# Altium schematic sheet 04 - Auxiliary Power.SchDoc: Auxiliary Power - 25kW WolfPACK FM3 Six-Pack Inv. (part 3 of 3)
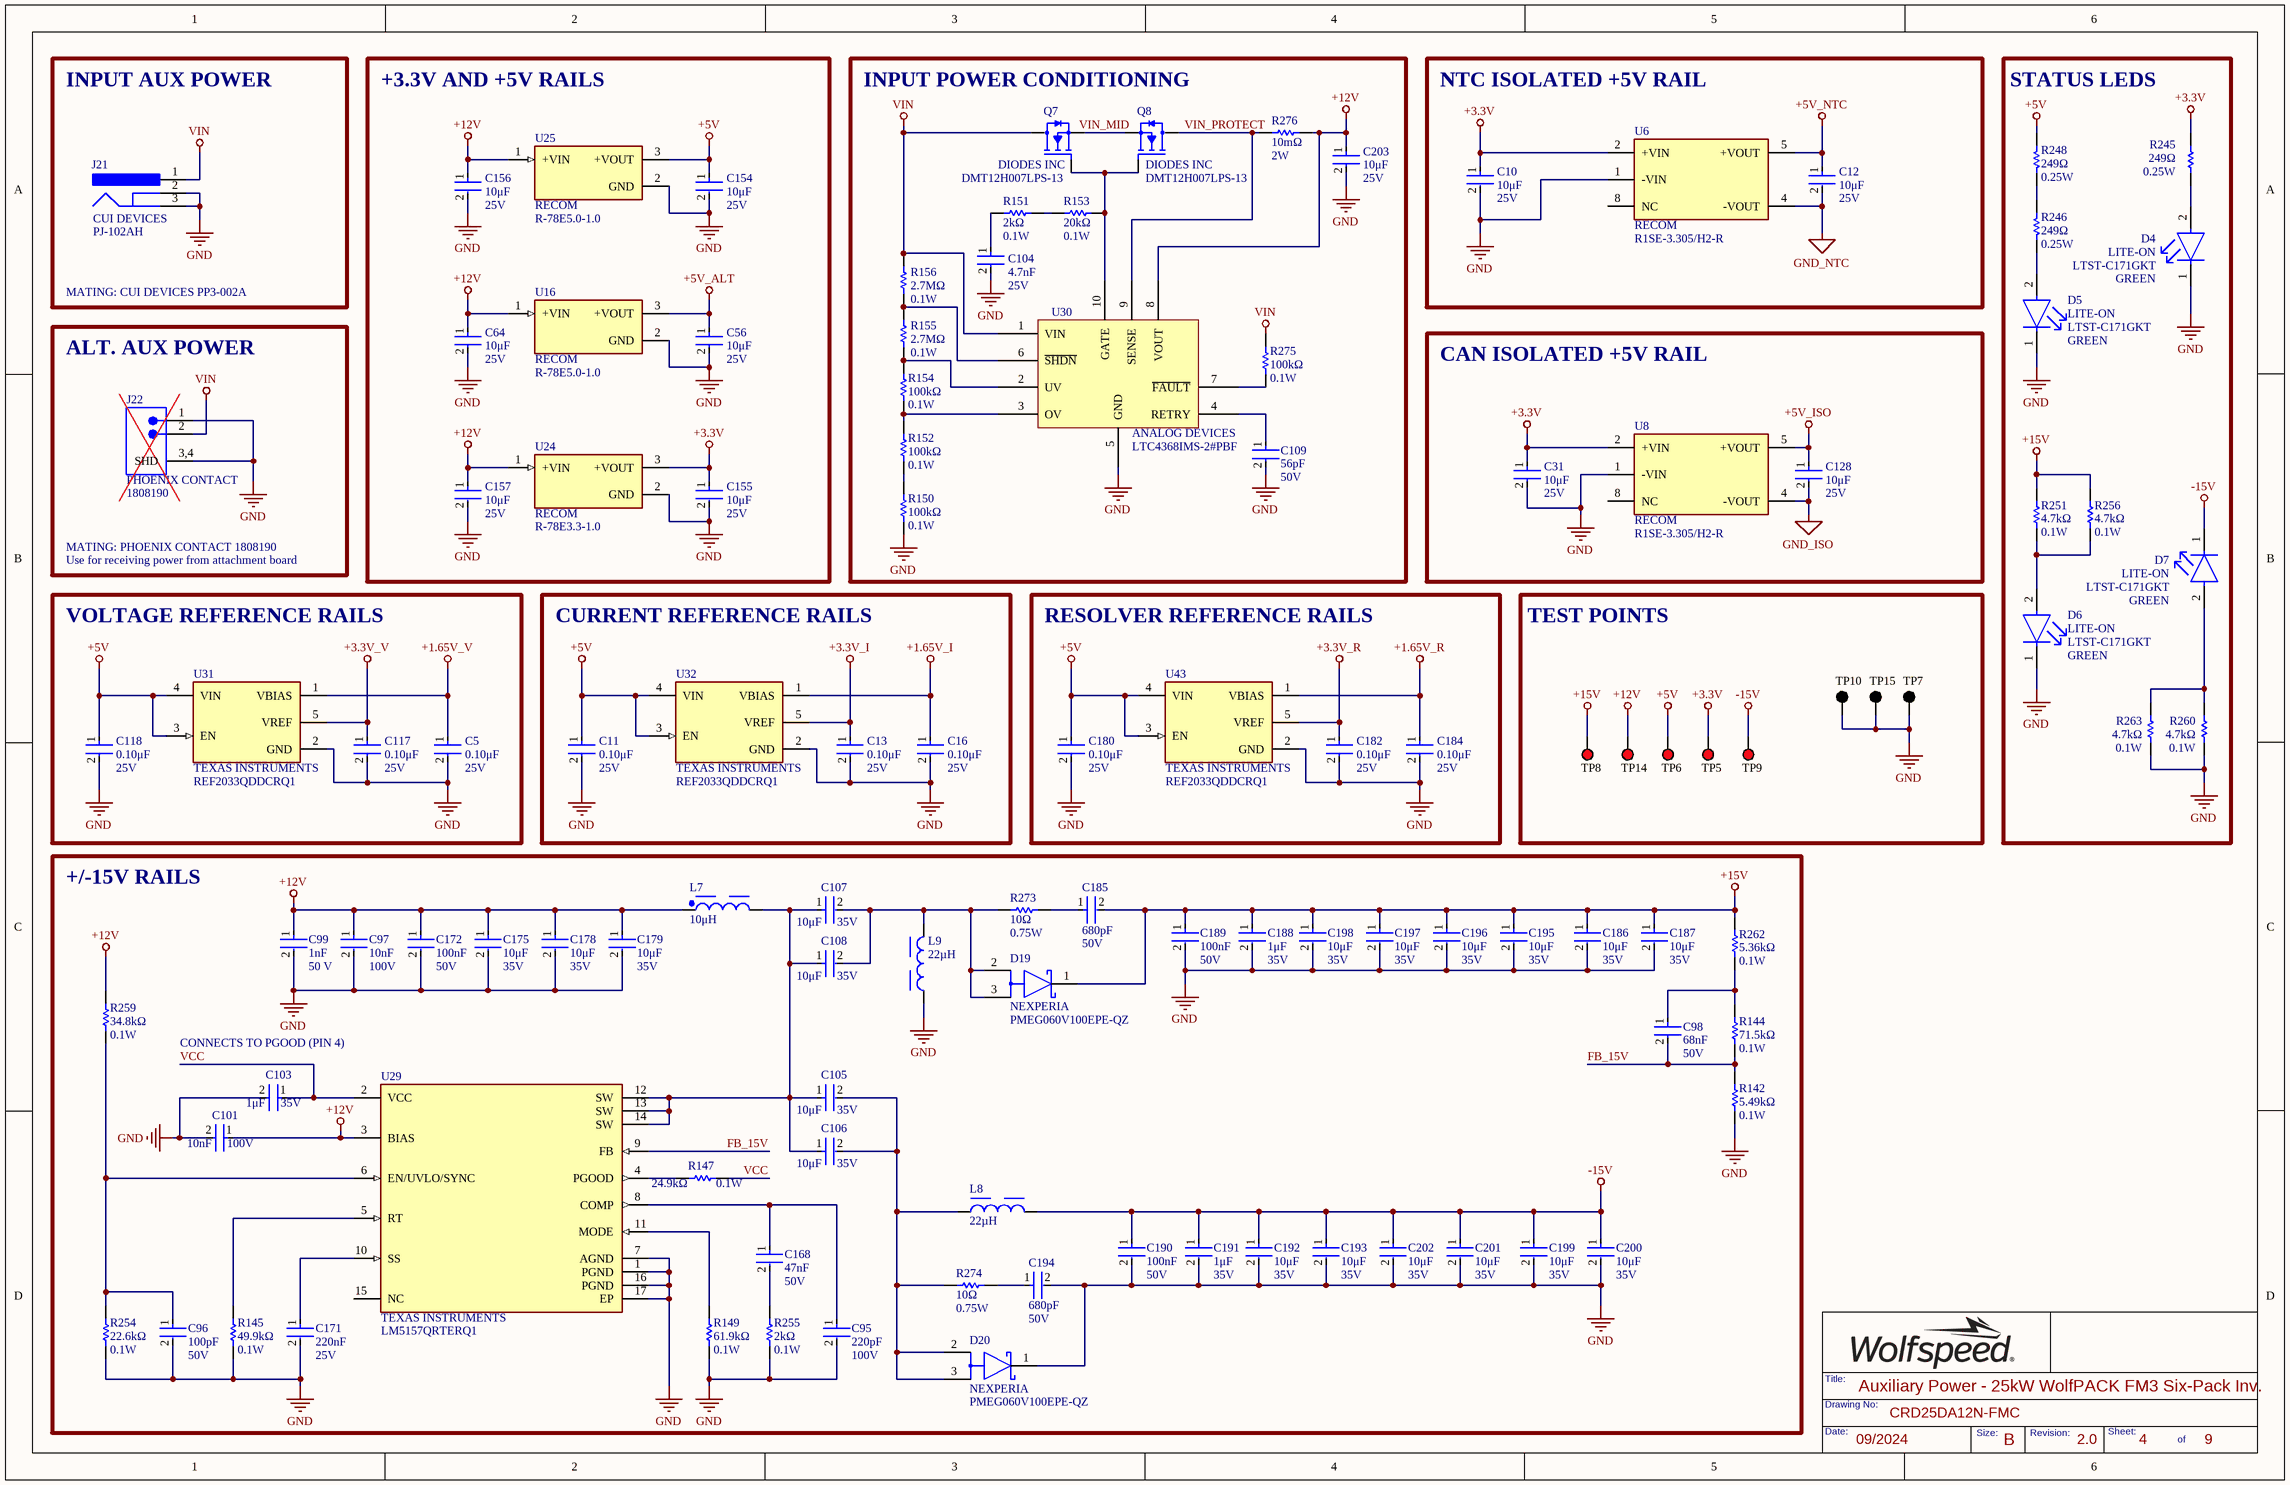
[diagram p2: 04 - Auxiliary Power.SchDoc]

## Library data of the parts (continued)
R262 = RT0603BRD075K36L: RES SMD 5.36KOHM 0.1% 1/10W 0603; Manufacturer: YAGEO; Temperature Coefficient: 25ppm/°C; Max Power Dissipation: 100mW; Voltage Rating: 75V; Voltage Rating (DC): 50V; Supplier 1: Digikey; Manufacturer Part Number: RT0603BRD075K36L; RoHS: Yes; Category: Chip SMD Resistors; Stock 1: 5772; Pricing 1: 1=0.13, 10=0.097, 50=0.0768, 100=0.0689, 500=0.05248, 1000=0.04637 (USD); Case/Package: 0603; Case Code (Metric): 1608; Case Code (Imperial): 0603; Min Operating Temperature: -55°C; Max Operating Temperature: 155°C; Resistance: 5.36kΩ; Tolerance: 0.1%; Packaging: Tape and Reel; Series: RT; Number of Terminations: 2; Termination: SMD/SMT; Package Quantity: 5000; Features: Moisture Resistant; Length: 0.063inch; Width: 0.031inch; Height: 0.022inch; RoHS Compliant: Yes; Lead Free: Lead Free; ComponentLink1URL: https://datasheet.ciiva.com/12706/pyu-rt-1-to-0-05-rohs-l-4-12706234.pdf?src-supplier=Mouser; ComponentLink1Description: https://datasheet.ciiva.com/12706/pyu-rt-1-to-0-05-rohs-l-4-12706234.pdf?src-supplier=Mouser; ComponentLink2URL: https://datasheet.ciiva.com/46635/pyu-rt-1-to-0-05-rohs-l-5-46635294.pdf?src-supplier=Digikey; ComponentLink2Description: https://datasheet.ciiva.com/46635/pyu-rt-1-to-0-05-rohs-l-5-46635294.pdf?src-supplier=Digikey; ComponentLink3URL: https://datasheet.ciiva.com/2586/pyu-rt-1-to-0-05-rohs-l-4-2586015.pdf?src-supplier=Digikey; ComponentLink3Description: https://datasheet.ciiva.com/2586/pyu-rt-1-to-0-05-rohs-l-4-2586015.pdf?src-supplier=Digikey; Supplier Part Number 1: YAG1697CT-ND; Package: 0603
R273 R274 = CRCW121010R0FKEAHP: RES SMD 10 OHM 1% 3/4W 1210; Manufacturer: VISHAY; Voltage Rating: 200V; Max Power Dissipation: 750mW; Temperature Coefficient: 100ppm/°C; Supplier 1: Mouser; Manufacturer Part Number: CRCW121010R0FKEAHP; RoHS: Yes; Category: Chip SMD Resistors; Stock 1: 37298; Pricing 1: 1=0.62, 10=0.237, 50=0.237, 100=0.203, 500=0.15, 1000=0.133, 5000=0.104, 10000=0.103, 50000=0.09 (USD); Case/Package: 1210; Weight: 0.000564oz; Case Code (Metric): 3225; Case Code (Imperial): 1210; Contact Plating: Tin; Min Operating Temperature: -55°C; Max Operating Temperature: 155°C; Packaging: Tape and Reel; Package Quantity: 10; Resistance: 10Ω; Tolerance: 1%; Number of Terminations: 2; Termination: SMD/SMT; Features: Automotive AEC-Q200; Series: CRCW-HP; Construction: Rectangular; Voltage Rating (DC): 200V; Length: 3.2mm; Width: 0.098inch; Height: 0.028inch; Depth: 2.5mm; Ratings: AEC-Q200; Military Standard: Not; Lead Free: Lead Free; RoHS Compliant: Yes; ComponentLink1URL: https://datasheet.ciiva.com/2478/crcwhpe3-2478099.pdf?src-supplier=Digikey; ComponentLink1Description: https://datasheet.ciiva.com/2478/crcwhpe3-2478099.pdf?src-supplier=Digikey; ComponentLink2URL: https://datasheet.ciiva.com/2478/crcwhpe3-2478100.pdf?src-supplier=Digikey; ComponentLink2Description: https://datasheet.ciiva.com/2478/crcwhpe3-2478100.pdf?src-supplier=Digikey; ComponentLink3URL: https://datasheet.ciiva.com/2478/crcwhpe3-2478101.pdf?src-supplier=Digikey; ComponentLink3Description: https://datasheet.ciiva.com/2478/crcwhpe3-2478101.pdf?src-supplier=Digikey; ComponentLink4URL: https://datasheet.ciiva.com/5544/crcwhpe3-46056-5544330.pdf?src-supplier=Mouser; ComponentLink4Description: https://datasheet.ciiva.com/5544/crcwhpe3-46056-5544330.pdf?src-supplier=Mouser; Supplier Part Number 1: 71-CRCW121010R0FKEAH; Package: 1210
R276 = PE2512FKE7W0R01L: RES 0.01 OHM 1% 2W 2512; Manufacturer: YAGEO; Temperature Coefficient: 50ppm/°C; Value: 10mΩ; Supplier 1: Rs; Manufacturer Part Number: PE2512FKE7W0R01L; RoHS: Yes; Category: Chip SMD Resistors; Stock 1: 2110; Package: 2512; Case Code (Metric): 6432; Case Code (Imperial): 2512; Min Operating Temperature: -55°C; Max Operating Temperature: 170°C; Packaging: Tape and Reel; Resistor Type: Metal Film; Number of Terminations: 2; Tolerance: 1%; Features: Moisture Resistant,Automotive AEC-Q200; Length: 0.248inch; Width: 0.122inch; Height: 0.03inch; Lead Free: Lead Free; ComponentLink1URL: http://www.mouser.com/ds/2/447/PYu-PE_521_RoHS_L_1-536447.pdf?src-supplier=Mouser; ComponentLink1Description: http://www.mouser.com/ds/2/447/PYu-PE_521_RoHS_L_1-536447.pdf?src-supplier=Mouser; ComponentLink2URL: http://www.yageo.com/NewPortal/yageodocoutput?fileName=/pdf/R-Chip/PYu-PE_521_RoHS_L_5.pdf&src-supplier=Digi-Key; ComponentLink2Description: http://www.yageo.com/NewPortal/yageodocoutput?fileName=/pdf/R-Chip/PYu-PE_521_RoHS_L_5.pdf&src-supplier=Digi-Key; Supplier Part Number 1: 1995902P
TP5 TP6 TP8 TP9 TP14 = CMP-1672-00002-4: PC TEST POINT MULTIPURPOSE RED; Manufacturer: KEYSTONE; Contact Material: Bronze; Mounting Technology: Through Hole; RoHSCompliant: true; Pins: 1; Package Quantity: 100; ComponentLink2Description: Datasheet; Height: 8.12 mm; ComponentLink1URL: http://www.keyelco.com/; DatasheetVersion: Rev. F, 12/2013; Mount: Through Hole; PackageReference: 5010; Contact Plating: Silver; Packaging: Bulk; Colour: Red; REACH SVHC: No SVHC; PackageDescription: 1-Pin Through Hole Device, Dia 3.17 mm; ComponentLink2URL: http://www.keyelco.com/product-pdf.cfm?p=1319; ComponentLink1Description: Manufacturer URL; Manufacturer Part Number: 5010; Value: RED; Package: N/A
TP7 TP10 TP15 = CMP-1672-00003-4: PC TEST POINT MULTIPURPOSE BLACK; Manufacturer: KEYSTONE; ComponentLink2URL: http://www.keyelco.com/product-pdf.cfm?p=1320; Colour: Black; Pins: 1; REACH SVHC: No SVHC; ComponentLink1URL: http://www.keyelco.com/; PackageReference: 5011; Contact Plating: Silver; Package Quantity: 100; Packaging: Bulk; RoHSCompliant: true; Height: 8.12 mm; PackageDescription: 1-Pin Through Hole Device, Dia 3.17 mm; Mount: Through Hole; Mounting Technology: Through Hole; DatasheetVersion: Rev. F, 12/2013; ComponentLink1Description: Manufacturer URL; Contact Material: Bronze; ComponentLink2Description: Datasheet; Manufacturer Part Number: 5011; Value: BLACK; Package: N/A
U6 U8 = R1SE-3.305/H2-R: DC DC CONVERTER 5V 1W; Number of Outputs: 1; Min Input Voltage: 2.97V; Max Input Voltage: 3.63V; Max Output Current: 200mA; Isolation Voltage: 2kV; Efficiency: 75%; Supplier 1: Digi-Key; RoHS: Yes; Category: Board Mount Modules; Stock 1: 563; Pricing 1: 1=4.51000, 5=4.44600, 10=4.38300, 25=4.25800, 50=4.00760, 100=3.88240, 250=3.75720 (USD); Mount: Surface Mount; Case/Package: SMD/SMT; Weight: 1g; Min Operating Temperature: -40°C; Max Operating Temperature: 100°C; Packaging: Cut Tape; Voltage - Output 1: 5V; Min Input Voltage (DC): 2.97V; Max Input Voltage (DC): 3.63V; Max Output Power: 1W; Current - Output 1: 200mA; Max Power Dissipation: 1W; Max Output Voltage: 5V; Series: ECONOLINE R1SE-H2 (1W); Length: 12.75mm; Width: 10.7mm; Height: 6.7mm; Depth: 12.75mm; Reach SVHC Compliant: Yes; Lead Free: Lead Free; RoHS Compliant: Yes; ComponentLink1URL: http://www.farnell.com/datasheets/1905443.pdf?src-supplier=Farnell; ComponentLink1Description: http://www.farnell.com/datasheets/1905443.pdf?src-supplier=Farnell; ComponentLink2URL: http://www.alliedelec.com/images/products/datasheets/bm/1_Datasheets/70595177.pdf?src-supplier=Allied+Electronics; ComponentLink2Description: http://www.alliedelec.com/images/products/datasheets/bm/1_Datasheets/70595177.pdf?src-supplier=Allied+Electronics; ComponentLink3URL: https://www.recom-power.com/pdf/Econoline/R1SE_H2.pdf?src-supplier=Digi-Key; ComponentLink3Description: https://www.recom-power.com/pdf/Econoline/R1SE_H2.pdf?src-supplier=Digi-Key; ComponentLink4URL: http://www.farnell.com/datasheets/1905443.pdf?src-supplier=Element14; ComponentLink4Description: http://www.farnell.com/datasheets/1905443.pdf?src-supplier=Element14; Supplier Part Number 1: 945-R1SE-3.305/H2-RCT-ND; Value: N/A; Package: 8-SMD; Manufacturer Part Number: R1SE-3.305/H2-R
U16 U25 = R-78E5.0-1.0: DC DC CONVERTER 5V 5W; Number of Outputs: 1; Min Input Voltage: 8V; Max Input Voltage: 28V; Max Output Current: 1A; Efficiency: 91%; Supplier 1: Rs; Manufacturer: RECOM; Manufacturer Part Number: R-78E5.0-1.0; RoHS: Yes; Category: Voltage Regulators - Switching; Stock 1: 661; Mount: Through Hole; Case/Package: SIP; Weight: 2g; Min Operating Temperature: -40°C; Max Operating Temperature: 85°C; Packaging: Rail/Tube; Voltage - Output 1: 5V; Max Power Dissipation: 5W; Output Power: 5W; Current - Output 1: 1A; Package Quantity: 42; Max Output Voltage: 5V; Features: SCP; Length: 11.6mm; Width: 8.5mm; Height: 10.4mm; Lead Free: Lead Free; RoHS Compliant: Yes; ComponentLink1URL: http://www.farnell.com/datasheets/2787646.pdf?src-supplier=Farnell; ComponentLink1Description: http://www.farnell.com/datasheets/2787646.pdf?src-supplier=Farnell; ComponentLink2URL: http://www.mouser.com/ds/2/468/R-78Exx-1.0-958279.pdf?src-supplier=Mouser; ComponentLink2Description: http://www.mouser.com/ds/2/468/R-78Exx-1.0-958279.pdf?src-supplier=Mouser; ComponentLink3URL: https://www.recom-power.com/pdf/Innoline/R-78Exx-1.0.pdf?src-supplier=Digi-Key; ComponentLink3Description: https://www.recom-power.com/pdf/Innoline/R-78Exx-1.0.pdf?src-supplier=Digi-Key; ComponentLink4URL: http://www.farnell.com/datasheets/1848475.pdf?src-supplier=Newark; ComponentLink4Description: http://www.farnell.com/datasheets/1848475.pdf?src-supplier=Newark; ComponentLink5URL: http://www.farnell.com/datasheets/2787646.pdf?src-supplier=Element14; ComponentLink5Description: http://www.farnell.com/datasheets/2787646.pdf?src-supplier=Element14; ComponentLink6URL: http://datasheet.octopart.com/R-78E5.0-1.0-Recom-Power-datasheet-68298118.pdf?src-supplier=Rs; ComponentLink6Description: http://datasheet.octopart.com/R-78E5.0-1.0-Recom-Power-datasheet-68298118.pdf?src-supplier=Rs; Supplier Part Number 1: 1446013; Package: 3-SIP; Value: N/A
U24 = R-78E3.3-1.0: DC DC CONVERTER 3.3V 3W; Number of Outputs: 1; Min Input Voltage: 8V; Max Input Voltage: 28V; Max Output Current: 1A; Efficiency: 91%; Max Output Power: 3.3W; Min Input Voltage (DC): 7V; Supplier 1: Rs; Manufacturer: RECOM; Manufacturer Part Number: R-78E3.3-1.0; RoHS: Yes; Category: Board Mount Modules; Stock 1: 1; Pricing 1: 1=3.93700, 5=3.82200, 10=3.69700, 25=3.58300, 50=3.46900 (USD); Mount: Through Hole; Case/Package: SIP; Weight: 2g; Min Operating Temperature: -40°C; Max Operating Temperature: 85°C; Packaging: Rail/Tube; Voltage - Output 1: 3.3V; Nominal Output Voltage: 3.3V; Max Input Voltage (DC): 28V; Max Power Dissipation: 3W; Max Output Voltage: 3.3V; Features: SCP; Series: INNOLINE R-78E; Length: 11.6mm; Width: 8.5mm; Height: 10.4mm; Reach SVHC Compliant: Yes; Lead Free: Lead Free; RoHS Compliant: Yes; ComponentLink1URL: http://www.farnell.com/datasheets/2787646.pdf?src-supplier=Farnell; ComponentLink1Description: http://www.farnell.com/datasheets/2787646.pdf?src-supplier=Farnell; ComponentLink2URL: https://www.recom-power.com/pdf/Innoline/R-78Exx-1.0.pdf?src-supplier=Digi-Key; ComponentLink2Description: https://www.recom-power.com/pdf/Innoline/R-78Exx-1.0.pdf?src-supplier=Digi-Key; ComponentLink3URL: http://www.farnell.com/datasheets/1965125.pdf?src-supplier=Element14; ComponentLink3Description: http://www.farnell.com/datasheets/1965125.pdf?src-supplier=Element14; ComponentLink4URL: http://www.farnell.com/datasheets/2787646.pdf?src-supplier=Newark; ComponentLink4Description: http://www.farnell.com/datasheets/2787646.pdf?src-supplier=Newark; Supplier Part Number 1: 9176626; Package: 3-SIP; Value: N/A
U29 = LM5157QRTERQ1: IC REG MULT CONFG ADJ 6.5A 16QFN; Supplier 1: Mouser; RoHS: No; Category: Voltage Regulators - Switching; Stock 1: 10233; Pricing 1: 1=4.45, 10=3.79, 50=3.79, 100=3.28, 250=3.11, 500=2.79, 1000=2.36, 3000=2.29, 10000=2.29 (USD); RoHS Compliant: Yes; Package: 16-WFQFN; Value: N/A; Supplier Part Number 1: 595-LM5157QRTERQ1; Manufacturer Part Number: LM5157QRTERQ1
U30 = LTC4368IMS-2#PBF: IC SURGE SUPPRESSION ADJ 10MSOP; Supplier 1: Digi-Key; Manufacturer: ANALOG DEVICES; Manufacturer Part Number: LTC4368IMS-2#PBF; RoHS: Yes; Category: Power Management ICs; Pricing 1: 1=6.69000, 10=6.03900, 25=5.75840, 100=5.00000, 250=4.77528, 500=4.35396, 1000=3.97500 (USD); ComponentLink1URL: http://www.linear.com/docs/57622?src-supplier=Digi-Key; ComponentLink1Description: http://www.linear.com/docs/57622?src-supplier=Digi-Key; Supplier Part Number 1: 505-LTC4368IMS-2#PBF-ND; Package: 10-MSOP; Value: N/A
U31 U32 U43 = REF2033QDDCRQ1: AUTOMOTIVE LOW-DRIFT, LOW-POWER,; Supplier 1: Mouser; Manufacturer Part Number: REF2033QDDCRQ1; RoHS: No; Category: Voltage References; Stock 1: 7420; Pricing 1: 1=3.59, 10=3.23, 50=3.23, 100=2.65, 1000=2.02, 10000=1.7 (USD); Supplier Part Number 1: 595-REF2033QDDCRQ1; Package: TSOT-23-5; Value: N/A